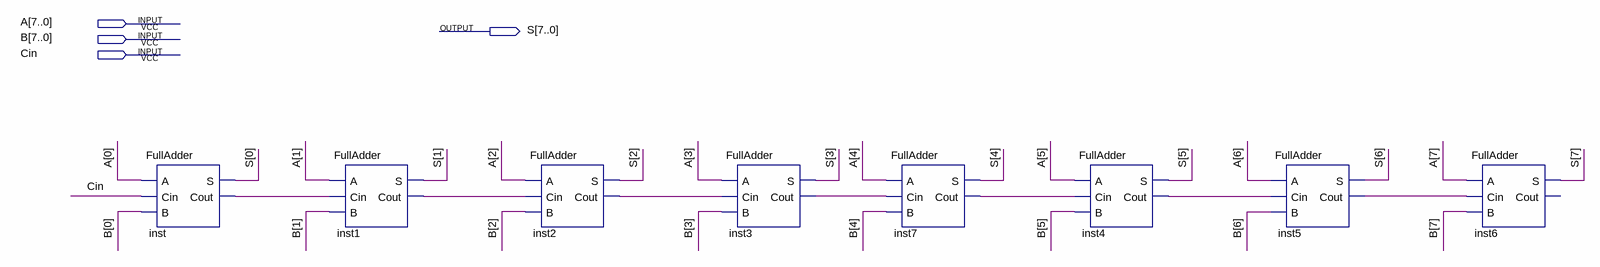
[diagram p0: schematic sheet]
// Quartus schematic RCA8b.bdf as structural Verilog: 8 symbols, 4 pins
module RCA8b (
  input  [7:0] A,
  input  [7:0] B,
  input  Cin,
  output [7:0] S
);

  wire inst1_cout, inst2_cout, inst3_cout, inst4_cout, inst5_cout, inst7_cout, inst_cout;

  FullAdder inst (.A(A[0]), .Cin(Cin), .B(B[0]), .S(S[0]), .Cout(inst_cout));
  FullAdder inst1 (.A(A[1]), .Cin(inst_cout), .B(B[1]), .S(S[1]), .Cout(inst1_cout));
  FullAdder inst2 (.A(A[2]), .Cin(inst1_cout), .B(B[2]), .S(S[2]), .Cout(inst2_cout));
  FullAdder inst3 (.A(A[3]), .Cin(inst2_cout), .B(B[3]), .S(S[3]), .Cout(inst3_cout));
  FullAdder inst7 (.A(A[4]), .Cin(inst3_cout), .B(B[4]), .S(S[4]), .Cout(inst7_cout));
  FullAdder inst4 (.A(A[5]), .Cin(inst7_cout), .B(B[5]), .S(S[5]), .Cout(inst4_cout));
  FullAdder inst5 (.A(A[6]), .Cin(inst4_cout), .B(B[6]), .S(S[6]), .Cout(inst5_cout));
  FullAdder inst6 (.A(A[7]), .Cin(inst5_cout), .B(B[7]), .S(S[7]));  // open: Cout
endmodule
